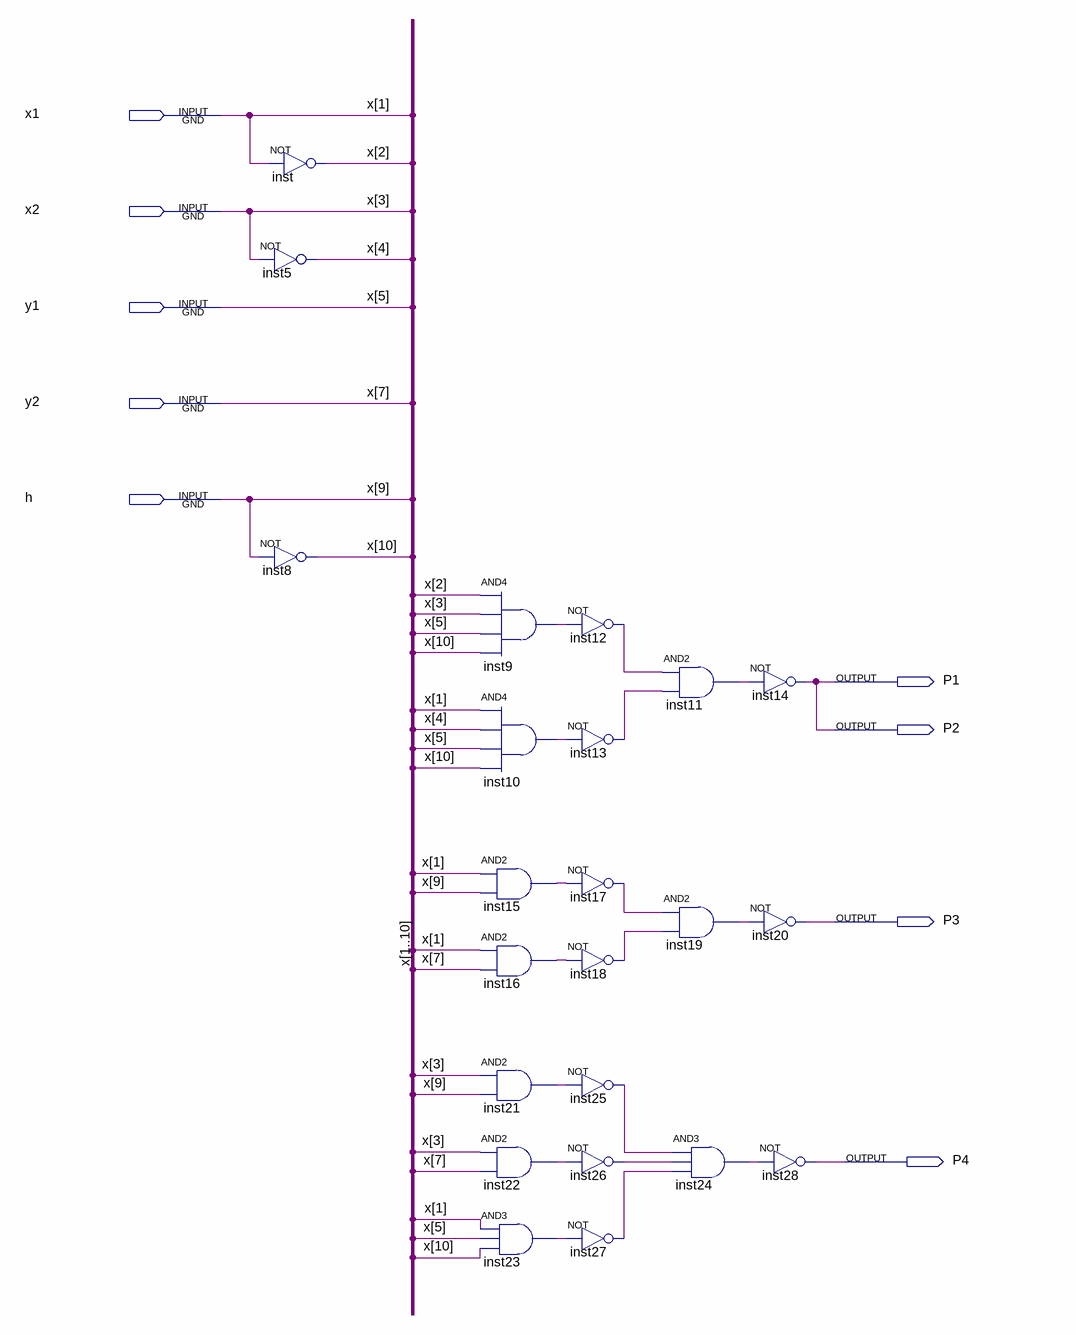
[diagram p0: schematic sheet]
// Quartus schematic ochu.bdf as structural Verilog: 23 symbols, 9 pins
module ochu (
  input  x1,
  input  x2,
  input  y1,
  input  y2,
  input  h,
  output P1,
  output P2,
  output P3,
  output P4
);

  wire inst9_out, inst10_out, inst11_out, inst12_out, inst13_out, inst15_out, inst16_out, inst17_out,
       inst18_out, inst19_out, inst21_out, inst22_out, inst23_out, inst24_out, inst25_out, inst26_out,
       inst27_out;
  wire [10:4] x;

  not inst (x2, x1);
  not inst5 (x[4], x2);
  not inst8 (x[10], h);
  and inst9 (inst9_out, x2, x2, y1, x[10]);
  and inst10 (inst10_out, x1, x[4], y1, x[10]);
  and inst15 (inst15_out, x1, h);
  and inst16 (inst16_out, x1, y2);
  and inst21 (inst21_out, x2, h);
  and inst22 (inst22_out, x2, y2);
  and inst23 (inst23_out, x1, y1, x[10]);
  not inst12 (inst12_out, inst9_out);
  not inst13 (inst13_out, inst10_out);
  not inst17 (inst17_out, inst15_out);
  not inst18 (inst18_out, inst16_out);
  not inst25 (inst25_out, inst21_out);
  not inst26 (inst26_out, inst22_out);
  not inst27 (inst27_out, inst23_out);
  and inst11 (inst11_out, inst12_out, inst13_out);
  and inst19 (inst19_out, inst17_out, inst18_out);
  and inst24 (inst24_out, inst25_out, inst26_out, inst27_out);
  not inst14 (P1, inst11_out);
  not inst20 (P3, inst19_out);
  not inst28 (P4, inst24_out);

  assign P2 = P1;

  // Other names for the same wires on the sheet: x (some bits) = {h, y2, y1, x2}
endmodule
